# EAGLE design WorkerB! (EAGLE 6.1)
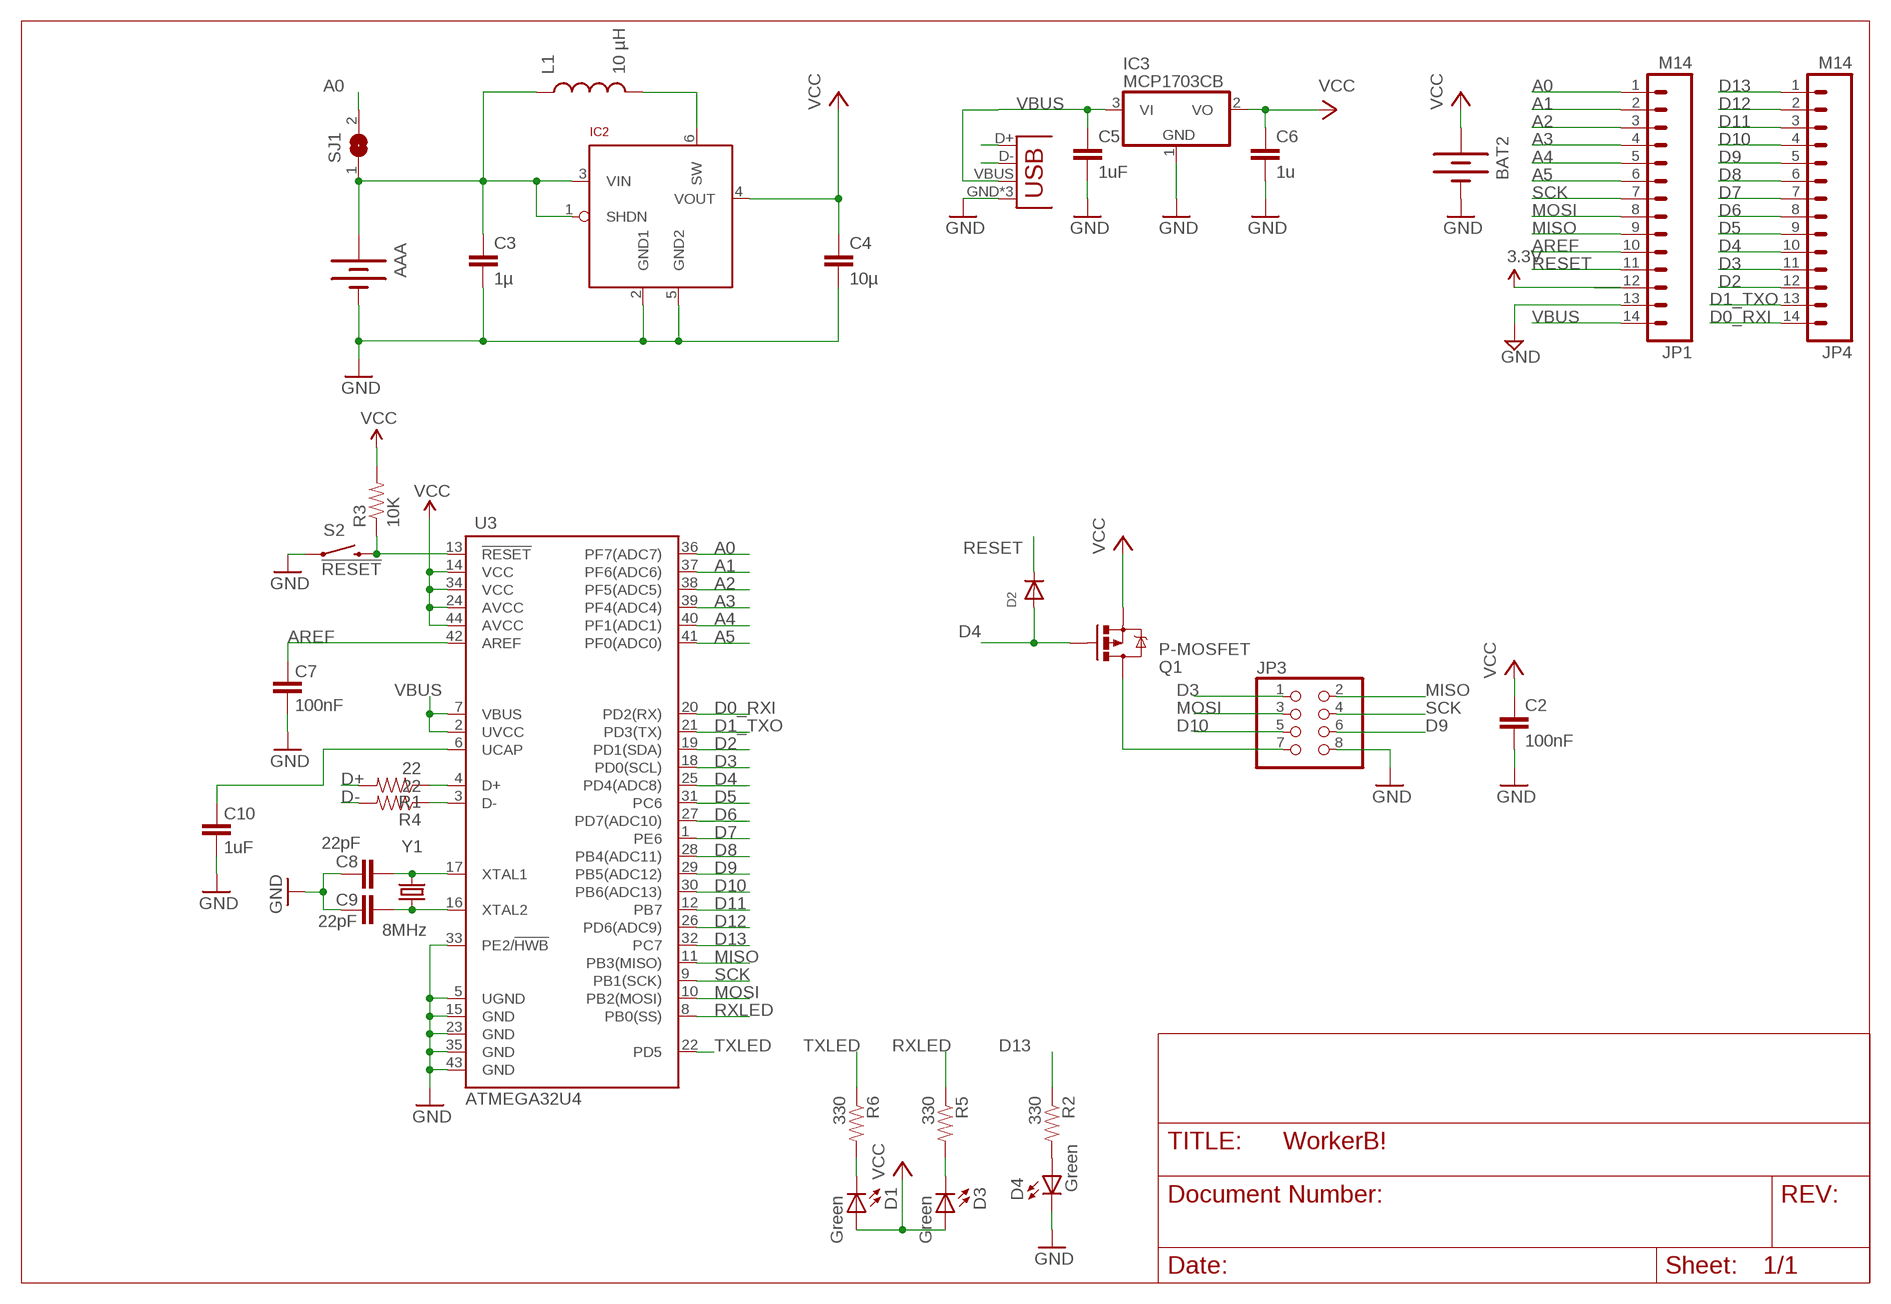
[diagram p0: schematic, sheet 1]

## Parts
AAA  BATTERYAAA-JL  [BATTERY-AAA-JL]
BAT2  BATTERY20PTH  [BATTCOM_20MM_PTH]
C2  100nF  C-EUC0603K  [C0603K]
C3  1µ  CAP0603-CAP  [0603-CAP]
C4  10µ  CAP0805  [0805]
C5  1uF  C-EUC0603K  [C0603K]
C6  1u  C-EUC0603K  [C0603K]
C7  100nF  CAP0402-CAP  [0402-CAP]
C8  22pF  CAP0402-CAP  [0402-CAP]
C9  22pF  CAP0402-CAP  [0402-CAP]
C10  1uF  CAP0402-CAP  [0402-CAP]
D1  Green  LED0603  [LED-0603]
D2  DIODESOD-323F  [SOD-323F]
D3  Green  LED0603  [LED-0603]
D4  Green  LED0603  [LED-0603]
IC2  LTC3525  [SC70]
IC3  MCP1703CB  [SOT23]
JP1  M14  [1X14]
JP2  USB-MICROB  [USB-MICROB]
JP3  PINHD-2X4  [2X04]
JP4  M14  [1X14]
L1  10 µH  INDUCTOR1210  [1210]
Q1  P-MOSFET  MOSFET-PCHANNEL  [SOT23]
R1  22  RESISTOR0402-RES  [0402-RES]
R2  330  RESISTOR0402-RES  [0402-RES]
R3  10K  RESISTOR0402-RES  [0402-RES]
R4  22  RESISTOR0402-RES  [0402-RES]
R5  330  RESISTOR0402-RES  [0402-RES]
R6  330  RESISTOR0402-RES  [0402-RES]
S2  !RESET  SWITCH-MOMENTARY-2SMD  [TACTILE_SWITCH_SMD]
SJ1  SJ  [SJ]
U3  ATMEGA32U4  ATMEGA32U4QFN2  [QFN-44-NOPAD]
Y1  8MHz  CRYSTAL5X3  [CRYSTAL-SMD-5X3]

## Nets
A0: JP1.1 SJ1.2 U3.36(PF7(ADC7))
A1: JP1.2 U3.37(PF6(ADC6))
A2: JP1.3 U3.38(PF5(ADC5))
A3: JP1.4 U3.39(PF4(ADC4))
A4: JP1.5 U3.40(PF1(ADC1))
A5: JP1.6 U3.41(PF0(ADC0))
AREF: C7.2 JP1.10 U3.42(AREF)
D0_RXI: JP4.14 U3.20(PD2(RX))
D1_TXO: JP4.13 U3.21(PD3(TX))
D2: JP4.12 U3.19(PD1(SDA))
D3: JP3.1 JP4.11 U3.18(PD0(SCL))
D4: D2.A JP4.10 Q1.1(G) U3.25(PD4(ADC8))
D5: JP4.9 U3.31(PC6)
D6: JP4.8 U3.27(PD7(ADC10))
D7: JP4.7 U3.1(PE6)
D8: JP4.6 U3.28(PB4(ADC11))
D9: JP3.6 JP4.5 U3.29(PB5(ADC12))
D10: JP3.5 JP4.4 U3.30(PB6(ADC13))
D11: JP4.3 U3.12(PB7)
D12: JP4.2 U3.26(PD6(ADC9))
D13: JP4.1 R2.1 U3.32(PC7)
D+: JP2.D+ R1.2
D-: JP2.D- R4.2
GND [power]: AAA.GND@1(-) BAT2.2(-) C2.2 C3.2 C4.2 C5.2 C6.2 C7.1 C8.2 C9.2 C10.1 D4.C IC2.2(GND1) IC2.5(GND2) IC3.1(GND) JP1.13 JP2.GND JP2.MT1(GND) JP2.MT2(GND) JP3.8 S2.1 U3.5(UGND) U3.15(GND) U3.23(GND) U3.33(PE2/!HWB) U3.35(GND) U3.43(GND)
MISO: JP1.9 JP3.2 U3.11(PB3(MISO))
MOSI: JP1.8 JP3.3 U3.10(PB2(MOSI))
N$1: C9.1 U3.16(XTAL2) Y1.1
N$2: R1.1 U3.4(D+)
N$3: D4.A R2.2
N$4: C8.1 U3.17(XTAL1) Y1.3
N$5: C10.2 U3.6(UCAP)
N$6: D3.C R5.2
N$7: R4.1 U3.3(D-)
N$8: D1.C R6.2
N$10: JP3.7 Q1.3(D)
N$13 [power]: IC2.6(SW) L1.2
RESET: D2.C JP1.11 R3.1 S2.3 U3.13(!RESET)
RXLED: R5.1 U3.8(PB0(SS))
SCK: JP1.7 JP3.4 U3.9(PB1(SCK))
TXLED: R6.1 U3.22(PD5)
VBUS [power]: C5.1 IC3.3(VI) JP1.14 JP2.VBUS U3.2(UVCC) U3.7(VBUS)
VCC [power]: BAT2.1(+) C2.1 C4.1 C6.1 D1.A D3.A IC2.4(VOUT) IC3.2(VO) JP1.12 Q1.2(S) R3.2 U3.14(VCC) U3.24(AVCC) U3.34(VCC) U3.44(AVCC) ; supply symbol labelled 3.3V
VIN: AAA.PWR@1(+) C3.1 IC2.1(SHDN) IC2.3(VIN) L1.1 SJ1.1

## Library data of the parts
AAA = JeeLabs:BATTERY: Battery Holders Various common sizes : AA, AAA, 20mm coin cell and 12mm coin cell.
BAT2 = SparkFun:BATTERY: Battery Holders Various common sizes : AA, AAA, 20mm coin cell and 12mm coin cell.
C2 C5 C6 = rcl:C-EU: CAPACITOR, European symbol
C3 C4 C7-C10 = SparkFun:CAP: Capacitor Standard 0603 ceramic capacitor, and 0.1" leaded capacitor.
D1 D3 D4 = SparkFun:LED: LEDs Standard schematic elements and footprints for 5mm, 3mm, 1206, and 0603 sized LEDs. 5mm - Spark Fun Electronics SKU : COM-00529 (and others)
D2 = adafruit:DIODE: Diode SMADIODE - SMA Surface Mount Package 20V 1A Schottky Diode Digikey: 641-1014-6-ND DO-1N4148 - Through Hole Small Current Diode SOD-123 20V 1 A (.5mV Vf) Schottky Diode - Digikey: MBRX120TPMSCT-ND SOD-323 10V 570mA (.38mV Vf, 3ns) Schottky Diode - Digikey: ZLLS410CT-ND SOD-523 30V 30mA Schottky Diode (RB751S-40TE61) - Digikey: RB751S-40TE61CT-ND SOT23-R/W - SOT23 Package (R = Solder Paste/Reflow Ovens, W = Hand-Soldering) BAT54Film 40V 300mA - Digikey: 497-7162-1-ND
IC2 = JeeLabs:LTC3525
IC3 = linear:MCP1703: 250 mA, 16V, Low Quiescent Current LDO Regulator Source: http://ww1.microchip.com/downloads/en/DeviceDoc/22049b.pdf
JP1 JP4 = SparkFun-Connectors:M14: Header 14 Standard 14-pin 0.1" header. Use with straight break away headers (SKU : PRT-00116), right angle break away headers (PRT-00553), swiss pins (PRT-00743), machine pins (PRT-00117), and female headers (PRT-00115).
JP2 = SparkFun-Connectors:USB: USB Connectors USB-B-PTH is fully proven SKU : PRT-00139/CONN-08278 USB-miniB is fully proven SKU : PRT-00587 USB-A-PCB is untested. USB-A-H is throughly reviewed, but untested. Spark Fun Electronics SKU : PRT-00437 USB-B-SMT is throughly reviewed, but untested. Needs silkscreen touching up. USB-A-S has not been used/tested USB-MB-H has not been used/tested USB-MICROB has been used. CONN-09505; PROD_ID: CONN-09505
JP3 = pinhead:PINHD-2X4: PIN HEADER
L1 = SparkFun:INDUCTOR: Inductors Basic Inductor/Choke - 0603 and 1206. Footprints are not proven and vary greatly between part numbers.
Q1 = SparkFun:MOSFET-PCHANNEL
R1-R6 = SparkFun:RESISTOR: Resistor Basic schematic elements and footprints for 0603, 1206, and PTH resistors.
S2 = SparkFun-Electromechanical:SWITCH-MOMENTARY-2: Various NO switches- pushbuttons, reed, etc; PROD_ID: SWCH-08247
SJ1 = jumper:SJ: SMD solder JUMPER
U3 = SparkFun:ATMEGA32U4
Y1 = SparkFun:CRYSTAL: Crystals Various standard crystals. Proven footprints. Spark Fun Electronics SKU : COM-00534

## Net classes
1 power: width 0.203 mm, clearance 0.152 mm

## Board
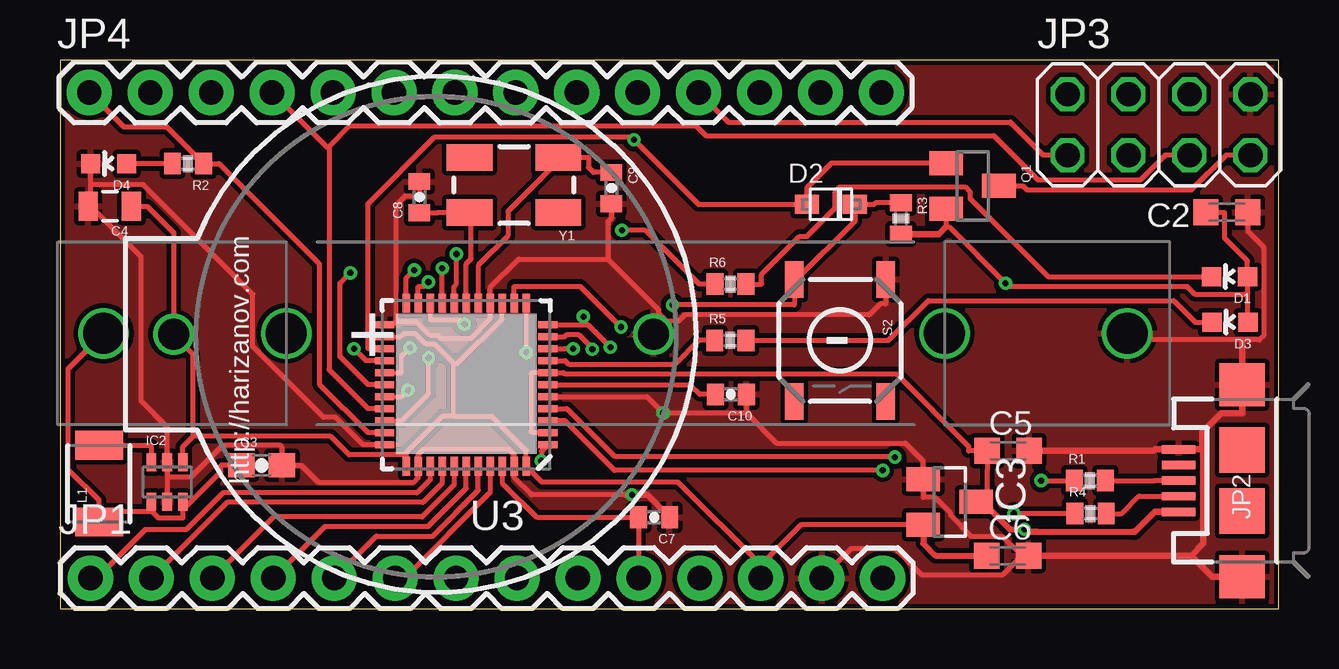
[diagram p1: board, top side]
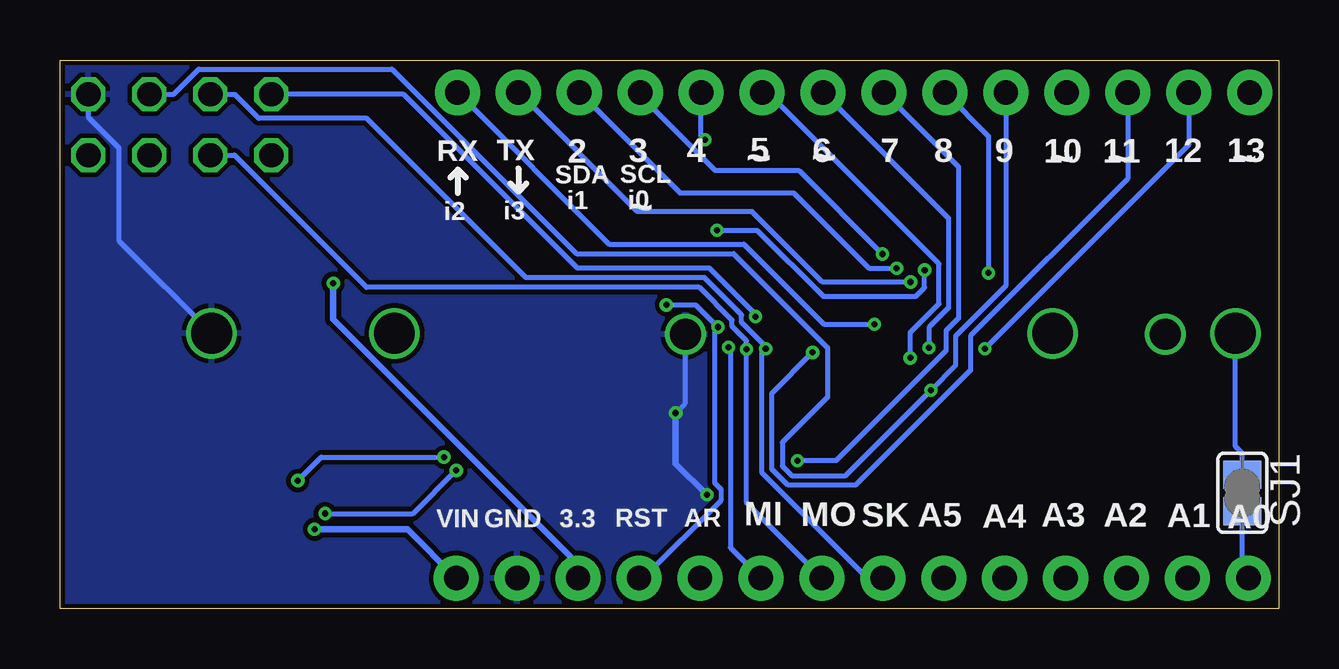
[diagram p2: board, bottom side, seen from below]

Size 50.81 x 22.86 mm. Coordinates in mm from the lower left corner, seen from the top.
Outline: 0,0 50.81,0 50.81,22.86 0,22.86 0,0
Copper layers (1*16): Top 0.035mm / dielectric 1.5mm / Bottom 0.035mm
Design rules: minimum track width 0.2mm, minimum drill 0.3mm, track to track 0.2mm, track to pad 0.2mm, pad to pad 0.2mm, via to via 0.2mm, smd to smd 0.2mm, copper to edge 0.2mm, drill to drill 0.2mm, minimum pad ring 0.2mm, minimum via ring 0.15mm, stop-mask expansion 0.075mm, vias tented up to drill 0.3mm, thermal gap 0.2mm

### Footprints (pad centres in the part's own frame; a part is rotated, then mirrored left to right if it is on the bottom)
BATTERY-AAA-JL = drill 1.702: GND@1 21.082,0; GND@2 13.462,0; PWR@1 -21.59,0; PWR@2 -13.97,0
BATTCOM_20MM_PTH = drill 1.3: 1 20,0; 2 0,0
C0603K = smd 1.05 x 1.08: 1 -0.875,0; 2 0.875,0
0603-CAP = smd 1.1 x 1: 1 -0.85,0; 2 0.85,0
0805 = smd 0.8 x 1.2: 1 -0.9,0; 2 0.9,0
0402-CAP = smd 0.7 x 0.9: 1 -0.65,0; 2 0.65,0
LED-0603 = smd 0.8 x 0.8: A 0,-0.75; C 0,0.75
SOD-323F = smd 1 x 0.8: A -1,0; C 1,0
SC70 = smd 0.4 x 0.75: 1 -0.65,-0.825; 2 0,-0.825; 3 0.65,-0.825; 4 0.65,0.825; 5 0,0.825; 6 -0.65,0.825
SOT23 = smd 1 x 1.4: 1 -0.95,-1.1; 2 0.95,-1.1; 3 0,1.1
1X14 = drill 1.016 pad 1.88: 1 0,0; 2 2.54,0; 3 5.08,0; 4 7.62,0; 5 10.16,0; 6 12.7,0; 7 15.24,0; 8 17.78,0; 9 20.32,0; 10 22.86,0; 11 25.4,0; 12 27.94,0; 13 30.48,0; 14 33.02,0
USB-MICROB = smd 0.35 x 1.4: D+ 0,2.65; D- -0.65,2.65; GND 1.3,2.65; ID 0.65,2.65; VBUS -1.3,2.65 | smd 1.8 x 1.9: MT1 -4,0; MT2 4,0 | smd 1.9 x 1.9: P$1 -1.27,0; P$2 1.27,0
2X04 = drill 1.016 octagon: 1 -3.81,-1.27; 2 -3.81,1.27; 3 -1.27,-1.27; 4 -1.27,1.27; 5 1.27,-1.27; 6 1.27,1.27; 7 3.81,-1.27; 8 3.81,1.27
1210 = smd 1.2 x 2: 1 -1.6,0; 2 1.6,0
0402-RES = smd 0.7 x 0.9: 1 -0.65,0; 2 0.65,0
TACTILE_SWITCH_SMD = smd 1.524 x 0.762: 1 -2.54,1.905; 2 2.54,1.905; 3 -2.54,-1.905; 4 2.54,-1.905
SJ = smd 1.168 x 1.6: 1 -0.762,0; 2 0.762,0
QFN-44-NOPAD = smd 0.8 x 0.3: 1 -3.4,2.5; 2 -3.4,2; 3 -3.4,1.5; 4 -3.4,1; 5 -3.4,0.5; 6 -3.4,0; 7 -3.4,-0.5; 8 -3.4,-1; 9 -3.4,-1.5; 10 -3.4,-2; 11 -3.4,-2.5; 23 3.4,-2.5; 24 3.4,-2; 25 3.4,-1.5; 26 3.4,-1; 27 3.4,-0.5; 28 3.4,0; 29 3.4,0.5; 30 3.4,1; 31 3.4,1.5; 32 3.4,2; 33 3.4,2.5 | smd 0.3 x 0.8: 12 -2.5,-3.4; 13 -2,-3.4; 14 -1.5,-3.4; 15 -1,-3.4; 16 -0.5,-3.4; 17 0,-3.4; 18 0.5,-3.4; 19 1,-3.4; 20 1.5,-3.4; 21 2,-3.4; 22 2.5,-3.4; 34 2.5,3.4; 35 2,3.4; 36 1.5,3.4; 37 1,3.4; 38 0.5,3.4; 39 0,3.4; 40 -0.5,3.4; 41 -1,3.4; 42 -1.5,3.4; 43 -2,3.4; 44 -2.5,3.4
CRYSTAL-SMD-5X3 = smd 1.9 x 1.1: 1 -1.85,-1.15; 2 1.85,-1.15; 3 1.85,1.15; 4 -1.85,1.15

### Placement (x,y rotation side)
AAA  23.4,11.47 0 top
BAT2  24.73,11.43 180 top
C2  48.64,16.51 0 top
C3  8.41,5.97 0 top
C4  2.08,16.76 180 top
C5  39.52,6.58 0 top
C6  39.5,2.21 0 top
C7  24.77,3.81 180 top
C8  14.99,17.14 90 top
C9  22.99,17.53 270 top
C10  27.97,8.93 180 top
D1  48.75,13.83 90 top
D2  32.14,16.85 0 top
D3  48.77,11.94 90 top
D4  2.03,18.54 90 top
IC2  4.47,5.28 0 top
IC3  37.08,4.45 270 top
JP1  1.27,1.27 0 top
JP2  49.28,5.33 90 top
JP3  45.81,20.16 0 top
JP4  1.22,21.51 0 top
L1  1.63,5.21 90 top
Q1  38.04,17.61 270 top
R1  42.93,5.33 0 top
R2  5.33,18.54 180 top
R3  35.05,16.26 270 top
R4  42.95,3.96 0 top
R5  27.94,11.18 0 top
R6  27.95,13.52 0 top
S2  32.51,11.18 270 top
SJ1  1.52,4.83 270 bottom
U3  16.94,9.33 180 top
Y1  18.92,17.65 180 top

### Tracks (layer width: path | path; a pad name or v marks a point on that pad's centre or on a via)
A0
  Top 0.2: U3.36 15.44,5.38 14.88,4.82 6.8,4.82 5.26,3.29 3.55,3.29 1.53,1.27 JP1.1
  Bottom 0.2: JP1.1 1.52,1.52 SJ1.2
A1
  Top 0.2: U3.37 15.94,5.23 15.13,4.42 6.96,4.42 JP1.2
A2
  Top 0.2: U3.38 16.43,5.16 15.1,3.82 8.9,3.82 JP1.3
A3
  Top 0.2: JP1.4 11.04,3.42 15.35,3.42 16.93,5.01 U3.39
A4
  Top 0.2: JP1.5 13.18,3.02 15.53,3.02 17.43,4.92 U3.40
A5
  Top 0.2: U3.41 17.93,4.85 14.36,1.27 JP1.6
AREF
  Top 0.2: U3.42 18.43,5.23 19.86,3.81 C7.2 24.11,1.28 JP1.10
D0_RXI  (via drill 0.25 pad 0.55)
  Top 0.2: v16.86,11.85 16.68,12.03 15.44,12.03 U3.20
  Bottom 0.2: JP4.14 27.92,15.19 22.3,15.19 18.96,11.85 v16.86,11.85
D1_TXO  (via drill 0.25 pad 0.55)
  Top 0.2: U3.21 14.94,13.43 15.17,13.43 v15.35,13.61
  Bottom 0.2: v15.35,13.61 19.02,13.61 21.96,16.55 26.74,16.55 JP4.13
D2  (via drill 0.25 pad 0.55)
  Top 0.2: U3.19 v15.94,14.19
  Bottom 0.2: JP4.12 24.97,17.32 20.22,17.32 17.09,14.19 v15.94,14.19
D3  (via drill 0.25 pad 0.55)
  Top 0.2: U3.18 16.43,13.43 16.53,13.52 v16.53,14.78 | JP3.1 40.99,18.89 39.62,20.27 27.86,20.27 JP4.11
  Bottom 0.2: JP4.11 26.62,21.39 23.5,18.26 20.01,18.26 v16.53,14.78
D4  (via drill 0.25 pad 0.55)
  Top 0.2: Q1.1 32.15,18.56 31.14,17.55 D2.A 26.61,16.85 v23.92,19.54 23.81,19.65 15.62,19.65 12.84,16.87 12.84,10.83 U3.25
  Bottom 0.2: v23.92,19.54 24.08,19.69 JP4.10
D5  (via drill 0.25 pad 0.55)
  Top 0.2: U3.31 14.23,7.83 15.37,8.96 v15.37,10.45
  Bottom 0.2: v15.37,10.45 15.37,11.51 14.17,12.7 14.17,14.37 21.31,21.51 JP4.9
D6  (via drill 0.25 pad 0.55)
  Top 0.2: U3.27 14.23,9.83 14.23,10.52 v14.59,10.87
  Bottom 0.2: JP4.8 13.77,16.28 13.77,12.54 14.59,11.72 v14.59,10.87
D7  (via drill 0.25 pad 0.55)
  Top 0.2: U3.1 20.06,6.56 v20.06,6.17
  Bottom 0.2: JP4.7 13.36,18.41 13.36,12.1 13.87,11.58 13.87,10.75 18.46,6.17 v20.06,6.17
D8  (via drill 0.25 pad 0.55)
  Top 0.2: U3.28 12.84,9.33 11.68,10.49 11.68,13.56 v12.1,13.99
  Bottom 0.2: JP4.6 12.1,19.69 v12.1,13.99
D9  (via drill 0.25 pad 0.55)
  Top 0.2: U3.29 14.23,8.83 v14.51,9.1
  Bottom 0.2: JP3.6 46.07,21.43 45.02,22.48 36.97,22.48 29.27,14.79 22.73,14.79 18.82,10.88 18.82,8.81 20.69,6.93 20.69,5.94 20.3,5.54 18.07,5.54 v14.51,9.1 13.47,10.13 13.47,11.36 11.38,13.45 JP4.5
D10
  Top 0.2: 11.21,19.24 12.08,20.11 26.52,20.11 26.92,19.71 38.92,19.71 40.77,17.86 45.04,17.86 46.07,18.89 JP3.5 | JP4.4 11.11,19.24 11.21,19.24 | 11.21,19.24 11.21,9.96 12.84,8.33 U3.30
D11  (via drill 0.25 pad 0.55)
  Top 0.2: U3.12 v19.43,10.68
  Bottom 0.2: JP4.3 6.3,17.91 12.85,11.36 12.85,9.93 17.64,5.14 20.46,5.14 21.14,5.82 21.14,8.97 v19.43,10.68
D12  (via drill 0.25 pad 0.55)
  Top 0.2: U3.26 12.75,10.33 v12.25,10.83
  Bottom 0.2: JP4.2 3.76,19.32 v12.25,10.83
D13
  Top 0.2: U3.32 12.84,7.33 10.81,9.36 10.81,14.37 6.63,18.54 R2.1 4.47,20.06 2.67,20.06 JP4.1
D+
  Top 0.2: R1.2 45.63,5.33 JP2.D+
D-
  Top 0.2: R4.2 44.25,3.96 44.97,4.68 JP2.D-
GND  (via drill 0.25 pad 0.55)
  Top 0.2: 28.62,8.15 v25.14,8.15 24.46,8.83 U3.5
  Top 0.203: 23.58,4.74 19.65,4.74 18.93,5.46 U3.43 18.93,6.42 18.72,6.63 15.15,6.63 14.94,6.42 U3.35 14.94,5.45 14.76,5.28 10.76,5.28 10.06,5.97 C3.2 9.26,6.72 9.17,6.81 6.78,6.81 5.45,5.48 4.47,5.48 | 22.84,14.57 24.95,12.46 24.95,12.31 25.28,11.98 | 22.84,14.57 19.12,14.57 17.93,13.38 U3.15 17.93,12.08 17.11,11.26 15.88,11.26 15.75,11.38 15.43,11.38 14.86,11.95 13.98,11.95 | 22.84,14.57 22.84,16.12 22.99,16.27 C9.2 | 25.28,11.98 25.78,11.98 26.05,12.24 33.74,12.24 34.19,12.69 34.41,12.69 34.42,12.7 S2.1 | 25.28,11.98 | BAT2.2 25.28,11.98 | AAA.GND@1 44.62,11.33 44.76,11.2 49.28,11.2 49.99,11.2 50.17,11.38 50.17,15.06 49.52,15.72 C2.2 | 13.98,11.95 13.87,11.83 U3.23 | 13.98,11.95 13.98,16.79 14.38,17.19 14.99,17.19 C8.2 | 40.18,2.21 39.98,2.21 | C4.2 1.28,16.76 | C10.1 28.62,8.15 29.87,6.89 35.24,6.89 35.98,6.15 IC3.1 35.98,4.64 36.46,4.64 37.13,3.97 37.13,3.88 38.01,3 39.29,3 39.98,2.31 39.98,2.21 | 4.47,5.48 IC2.5 4.47,7.56 3.38,8.65 3.38,14.67 1.28,16.76 | 4.47,5.48 IC2.2 | 1.28,16.76 1.28,17.67 | 1.28,17.67 D4.C | JP1.13 32.99,2.51 34.82,2.51 35.91,1.42 39.3,1.42 39.98,2.1 39.98,2.21 | U3.33 12.63,6.83 11.49,7.97 10.98,7.97 8.03,10.92 8.03,13.1 3.47,17.67 1.28,17.67
  Top 0.279: C7.1 24.48,4.74 v23.84,4.74 23.58,4.74 | C5.2 45.58,6.58 45.63,6.63 JP2.GND 47.62,6.63 | 47.16,2.21 48.03,1.33 JP2.MT1 | 47.16,2.21 C6.2 40.18,2.21 | 47.62,6.63 47.67,6.59 47.67,2.72 47.16,2.21 | 47.62,6.63 47.62,7.36 48.4,8.14 49.28,8.14 JP2.MT2 49.28,11.2
  Bottom 0.203: v25.14,8.15 24.73,8.56 BAT2.2 | JP3.8 49.62,20.47 48.35,19.2 48.35,15.33 AAA.GND@1
  Bottom 0.279: v23.84,4.74 25.14,6.04 v25.14,8.15
  pour Bottom: 0,22.86 50.8,22.86 50.8,0 0,0
  pour Top: 0,22.86 50.8,22.86 50.8,0 0,0
MISO  (via drill 0.25 pad 0.55)
  Top 0.2: 21.82,11.83 22,11.83 v22.94,10.89 | U3.11 21.82,11.83 | 21.82,11.83 v21.82,12.17
  Bottom 0.2: v21.82,12.17 21.82,12.27 23.74,14.19 29.24,14.19 36.48,21.43 JP3.2 | v22.94,10.89 22.86,10.81 22.86,2.54 JP1.9
MOSI  (via drill 0.25 pad 0.55)
  Top 0.2: U3.10 21.04,11.33 21.11,11.41 21.63,11.41 22.19,10.85 v22.19,10.81
  Bottom 0.2: JP3.3 43.53,18.89 38.03,13.39 24.16,13.39 22.8,12.02 22.8,11.76 22.19,11.16 v22.19,10.81 22.19,4.41 JP1.8
N$1
  Top 0.2: 20.92,18.8 18.67,16.55 18.67,15.54 17.43,14.3 U3.16 | 20.92,18.8 22.02,18.8 22.02,18.39 22.24,18.18 C9.1 | Y1.1 20.92,18.8
N$2  (via drill 0.25 pad 0.55)
  Top 0.2: v40.89,5.33 R1.1 | U3.4 21.13,8.33 23.11,6.35 34.77,6.35 v34.8,6.32
  Bottom 0.2: v40.89,5.33 39.91,6.32 v34.8,6.32
N$3
  Top 0.2: R2.2 D4.A
N$4
  Top 0.2: U3.17 16.93,14.37 17.14,14.58 17.14,16.43 Y1.3 15.74,16.5 C8.1
N$5
  Top 0.2: U3.6 26.27,9.33 26.67,8.93 C10.2
N$6
  Top 0.2: R5.2 34.54,11.18 36.19,12.83 46.42,12.83 47.32,11.94 D3.C
N$7  (via drill 0.25 pad 0.55)
  Top 0.2: R4.1 v39.76,3.96 | v34.29,5.76 23.11,5.76 21.04,7.83 U3.3
  Bottom 0.2: v39.76,3.96 36.09,3.96 v34.29,5.76
N$8
  Top 0.2: R6.2 29.25,13.52 29.25,13.93 30.82,15.51 31.13,15.51 32.31,16.69 32.31,17.37 32.51,17.57 37.74,17.57 37.94,17.37 37.94,17.09 41.19,13.83 D1.C
N$10
  Top 0.2: JP3.7 48.61,18.89 47.17,17.45 40.3,17.45 40.14,17.61 Q1.3
N$13
  Top 0.203: IC2.6 3.82,6.74 3.75,6.81 L1.2
RESET  (via drill 0.25 pad 0.55)
  Top 0.2: v23.38,11.73 21.69,13.43 18.93,13.43 U3.13 | v25.53,12.65 30.61,12.65 S2.3 30.71,13.72 33.14,16.15 D2.C 33.94,16.85 34,16.91 R3.1
  Bottom 0.2: 23.52,11.73 23.52,5.24 23.26,4.98 23.26,4.5 26.5,1.27 JP1.11 | 23.52,11.73 v23.38,11.73 | v25.53,12.65 24.31,12.65 23.52,11.87 23.52,11.73
RXLED
  Top 0.2: U3.8 21.06,10.33 21.2,10.18 25.65,10.18 26.64,11.18 R5.1
SCK  (via drill 0.25 pad 0.55)
  Top 0.2: v21.39,10.83 21.04,10.83 U3.9
  Bottom 0.2: JP3.4 43.53,21.43 42.52,20.42 38.02,20.42 31.38,13.79 23.94,13.79 22.39,12.24 22.39,11.93 21.39,10.92 v21.39,10.83 21.54,10.68 21.54,5.66 17.16,1.27 JP1.7
TXLED  (via drill 0.25 pad 0.55)
  Top 0.2: v23.42,15.77 24.4,15.77 26.65,13.52 R6.1 | U3.22 14.44,13.78 v14.77,14.11
  Bottom 0.2: v23.42,15.77 21.75,15.77 18.99,13.01 15.13,13.01 14.77,13.38 v14.77,14.11
VBUS  (via drill 0.25 pad 0.55)
  Top 0.203: 38.65,4.45 38.65,4.25 | 40.2,3.21 40.33,3.21 | U3.2 19.68,7.33 19.63,7.38 19.63,9.78 19.68,9.83 U3.7 20.99,9.83 21.04,9.78 34.86,9.78 37.87,6.77 37.87,6.58 C5.1 38.65,5.79 38.65,4.45 | IC3.3 38.65,4.45
  Top 0.254: 38.65,4.25 39.59,3.31 v40.2,3.31 | 40.73,3.21 44.71,3.21
  Top 0.279: 40.2,3.21 v40.2,3.31 | 40.33,3.21 40.73,3.21 | JP2.VBUS 45.63,4.03 44.81,3.21 44.71,3.21
  Bottom 0.279: v40.2,3.31 36.33,3.31 JP1.14
VCC  (via drill 0.25 pad 0.55)
  Top 0.203: Q1.2 36.94,15.91 37.06,15.91 v39.41,13.56 | 39.41,13.43 46.98,13.43 47.3,13.11 49.42,13.11 49.5,13.18 | 29.21,1.82 25.76,5.27 20.09,5.27 U3.44 19.43,6.58 18,8.02 16.41,8.02 | 16.41,10.21 15.6,11.03 15.26,11.03 14.82,11.46 14.32,11.46 14.19,11.33 U3.24 | 16.41,8.02 16.41,10.21 | 16.41,10.21 16.58,10.21 18.43,12.07 U3.14 | C2.1 48.55,16.51 48.55,15.44 49.5,14.49 D1.A 49.5,13.18 | D3.A 49.52,13.16 49.5,13.18 | IC3.2 30.88,3.5 29.21,1.82 | C4.1 3.64,16.76 4.73,15.67 BAT2.1 5.56,10.61 5.56,7.18 | 29.21,1.82 JP1.12 | IC2.4 5.12,6.74 5.56,7.18 | 16.41,8.02 15.96,8.02 14.44,6.5 14.44,6.41 | 14.44,6.41 U3.34 | 14.44,6.41 12.05,6.41 11.28,7.18 5.56,7.18
  Top 0.254: IC3.2 35.98,2.72 36.49,2.21 C6.1
  Top 0.279: R3.2 36.63,15.61 36.94,15.91 | v39.41,13.56 39.41,13.43
  Bottom 0.279: JP1.12 29.21,1.84 39.41,12.05 v39.41,13.56 | v39.41,13.56
VIN
  Top 0.2: C3.1 6.71,5.97 6.71,5.71 5.12,4.12 | 5.12,4.12 5.12,3.78 4.09,3.78 3.82,4.06 | IC2.3 5.12,4.12 | 1.63,4.06 3.82,4.06 | IC2.1 3.82,4.06 | 1.63,4.06 1.63,4.51 0.33,5.81 0.33,9.98 AAA.PWR@1 | L1.1 1.63,4.06
  Bottom 0.2: SJ1.1 1.52,6.47 1.81,6.76 AAA.PWR@1

### Text on the board
tPlace: http://harizanov.com
_bsilk: 13 | 12 | 11 | 10 | 9 | 8 | 7 | 6 | 5 | 4 | 3 | 2 | TX | RX | ~ | ~ | ~ | ~ | ~ | SCL | SDA | i0 | i1 | ~ | i3 | i2 | AR | RST | GND | A0 | A1 | A2 | A3 | A4 | A5 | SK | MO | MI | 3.3 | VIN